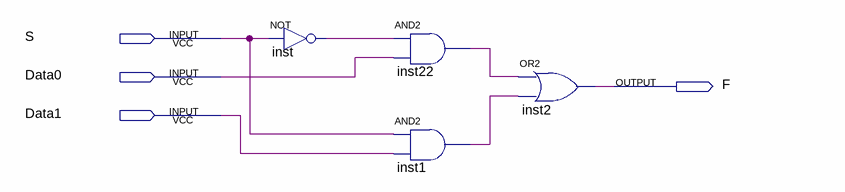
[diagram p0: schematic sheet]
// Quartus schematic mux21.bdf as structural Verilog: 4 symbols, 4 pins
module mux21 (
  input  S,
  input  Data0,
  input  Data1,
  output F
);

  wire inst1_out, inst22_out, inst_out;

  not inst (inst_out, S);
  and inst22 (inst22_out, inst_out, Data0);
  and inst1 (inst1_out, S, Data1);
  or inst2 (F, inst22_out, inst1_out);
endmodule
